# EAGLE design power scheduler (EAGLE 8.6.3)
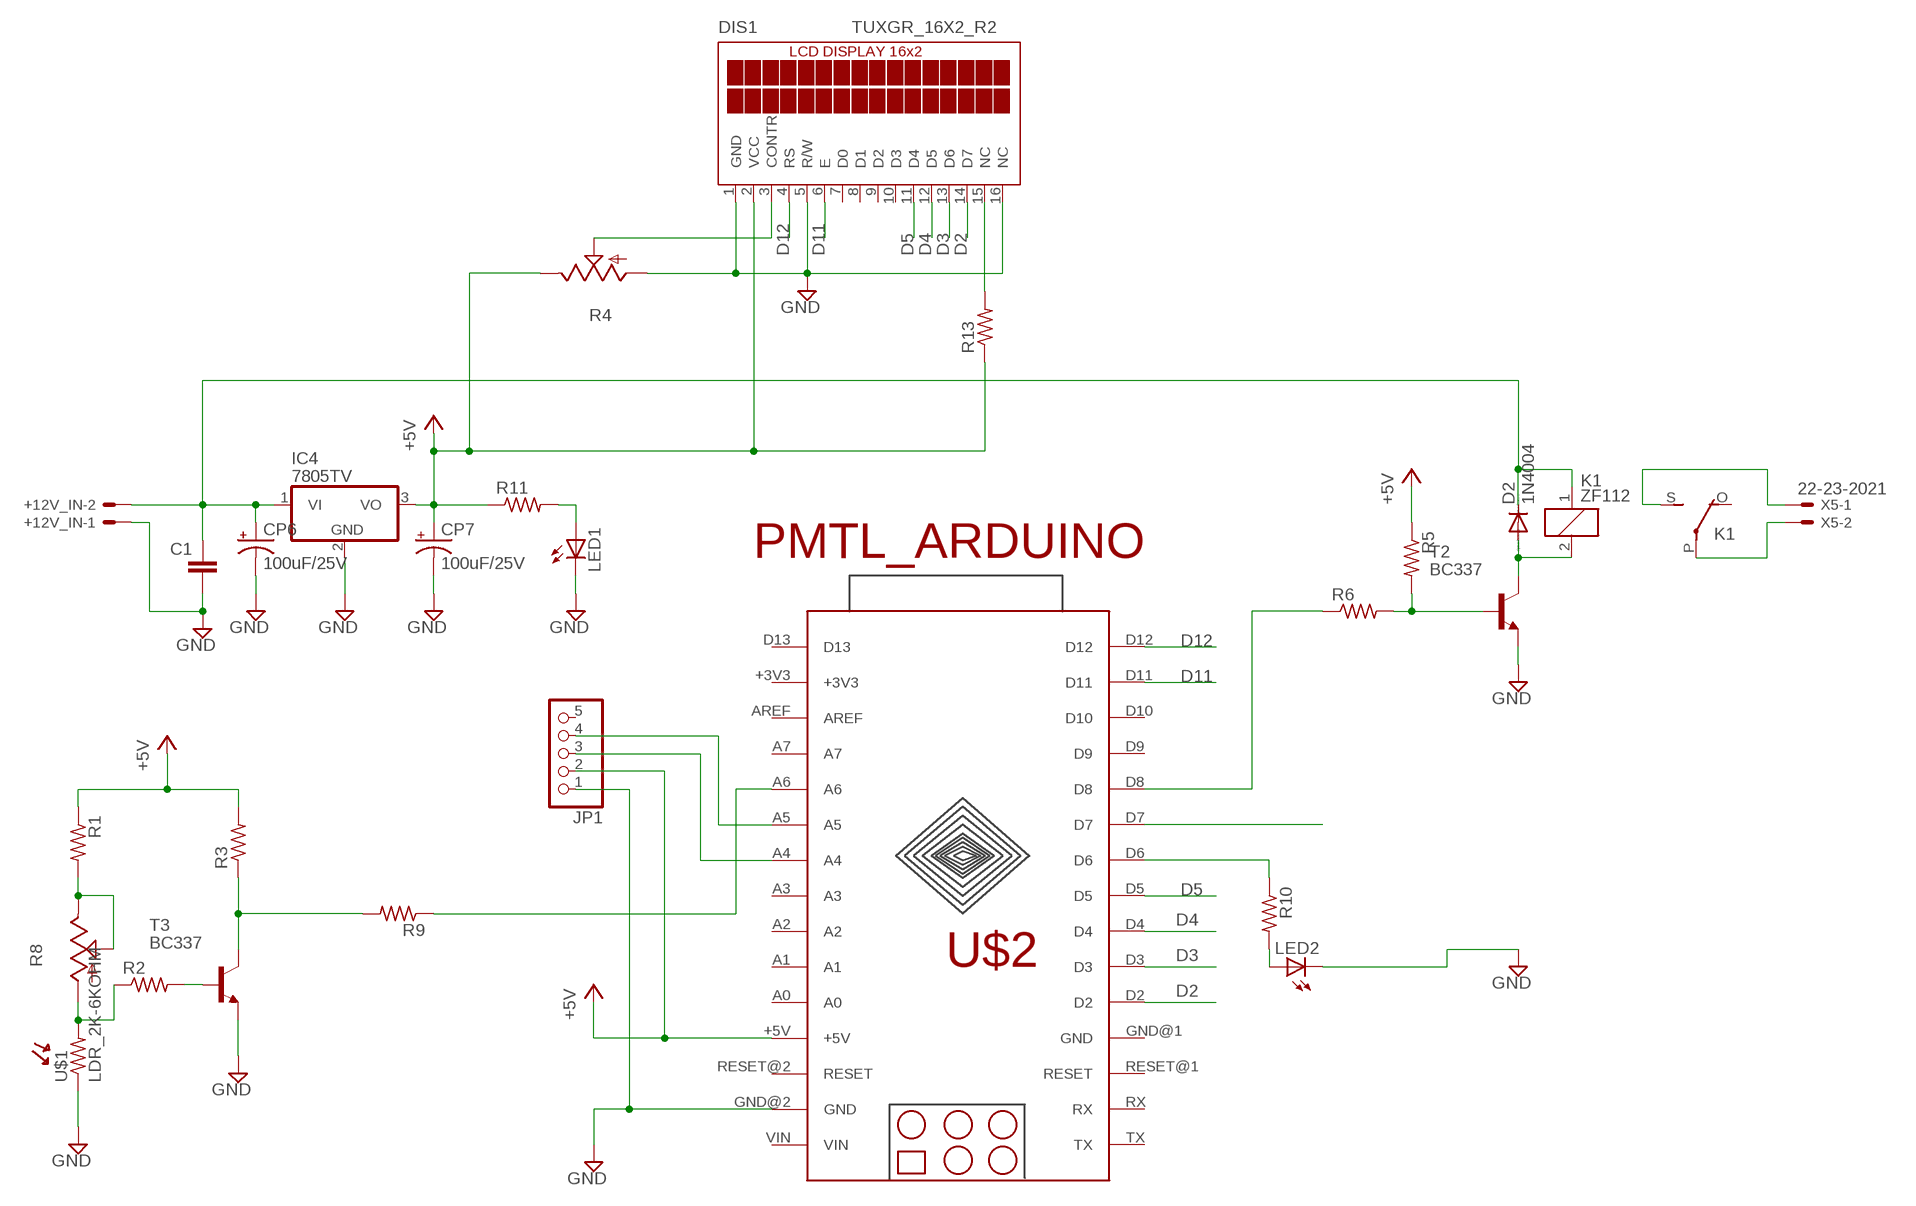
[diagram p0: schematic, sheet 1]

## Parts
+12V_IN  22-23-2021  [22-23-2021]
C1  C-EU025-025X050  [C025-025X050]
CP6  100uF/25V  CPOL-USE2-5  [E2-5]
CP7  100uF/25V  CPOL-USE2-5  [E2-5]
D2  1N4004  [DO41-10]
DIS1  TUXGR_16X2_R2  [TUXGR_16X2_R2]
IC4  7805TV  [TO220V]
JP1  PINHD-1X5/90  [1X05/90]
K1  ZF112  [ZF112]
LED1  LED3MM  [LED3MM]
LED2  LED3MM  [LED3MM]
R1  R-US_0204/7  [0204/7]
R2  R-US_0204/7  [0204/7]
R3  R-US_0204/7  [0204/7]
R4  TRIM  [6MM]
R5  R-US_0204/7  [0204/7]
R6  R-US_0204/7  [0204/7]
R8  TRIM  [6MM]
R9  R-US_0204/7  [0204/7]
R10  R-US_0204/7  [0204/7]
R11  R-US_0204/7  [0204/7]
R13  R-US_0204/7  [0204/7]
T2  BC337  [TO92]
T3  BC337  [TO92]
U$1  LDR_2K-6KOHM  [XDCR_PDV-P9003-1]
U$2  PMTL_ARDUINO  [PMTL_ARDUINO]
X5  22-23-2021  [22-23-2021]

## Nets
+5V: CP7.+ DIS1.2(VCC) IC4.3(VO) JP1.2 R1.1 R3.2 R4.E R5.1 R11.1 R13.1 U$2.+5V
D2: DIS1.14(D7) U$2.D2
D3: DIS1.13(D6) U$2.D3
D4: DIS1.12(D5) U$2.D4
D5: DIS1.11(D4) U$2.D5
D11: DIS1.6(E) U$2.D11
D12: DIS1.4(RS) U$2.D12
GND: +12V_IN.1 C1.2 CP6.- CP7.- DIS1.1(GND) DIS1.5(R/W) DIS1.16(NC) IC4.2(GND) JP1.1 LED1.K(C) LED2.K(C) R4.A T2.1(E) T3.1(E) U$1.1 U$2.GND@2(GND)
N$1: K1.S(2:S) X5.1
N$2: K1.P(2:P) X5.2
N$3: R2.1 R8.A U$1.2
N$4: R1.2 R8.E R8.S
N$5: D2.A K1.2 T2.3(C)
N$6: JP1.4 U$2.A5
N$7: +12V_IN.2 C1.1 CP6.+ D2.C IC4.1(VI) K1.1
N$9: R5.2 R6.2 T2.2(B)
N$11: R6.1 U$2.D8
N$13: R9.1 U$2.A6
N$14: JP1.3 U$2.A4
N$17: R2.2 T3.2(B)
N$18: R3.1 R9.2 T3.3(C)
N$19: LED1.A R11.2
N$21: LED2.A R10.2
N$22: DIS1.3(CONTR) R4.S
N$24: DIS1.15(NC) R13.2
N$33: R10.1 U$2.D6
N$34: U$2.D7
Unconnected: DIS1.7(D0) DIS1.8(D1) DIS1.9(D2) DIS1.10(D3) JP1.5 K1.O(2:O) U$2.+3V3 U$2.A0 U$2.A1 U$2.A2 U$2.A3 U$2.A7 U$2.AREF U$2.D9 U$2.D10 U$2.D13 U$2.GND@1(GND) U$2.RESET@1(RESET) U$2.RESET@2(RESET) U$2.RX U$2.TX U$2.VIN

## Library data of the parts
+12V_IN X5 = con-molex:22-23-2021: .100" (2.54mm) Center Header - 2 Pin; MF: MOLEX; MPN: 22-23-2021; OC_FARNELL: 1462926; OC_NEWARK: 25C3832
C1 = rcl:C-EU: CAPACITOR, European symbol; SPICEPREFIX: C
CP6 CP7 = rcl:CPOL-US: POLARIZED CAPACITOR, American symbol; SPICEPREFIX: C
D2 = diode:1N4004: DIODE general purpose rectifier, 1 A
DIS1 = display-lcd:TUXGR_16X2_R2: Tuxgraphics LCD display 16x2 characters reflective, without background light Source: tuxgr_12x2_r2.pdf; OC_FARNELL: unknown; OC_NEWARK: unknown
IC4 = linear:78*: Positive VOLTAGE REGULATOR Source: http://cache.national.com/ds/LM/LM78L05.pdf http://www.fairchildsemi.com/ds/LM/LM7805.pdf
JP1 = pinhead:PINHD-1X5: PIN HEADER
K1 = relay:ZF112: RELAY 1 x switch; OC_FARNELL: unknown; OC_NEWARK: unknown
LED1 LED2 = adafruit:LED: LED OSRAM: - CHIPLED LG R971, LG N971, LY N971, LG Q971, LY Q971, LO R971, LY R971 LH N974, LH R974 LS Q976, LO Q976, LY Q976 LO Q996 - Hyper CHIPLED LW Q18S LB Q993, LB Q99A, LB R99A - SideLED LS A670, LO A670, LY A670, LG A670, LP A670 LB A673, LV A673, LT A673, LW A673 LH A674 LY A675 LS A676, LA A676, LO A676, LY A676, LW A676 LS A679, LY A679, LG A679 - Hyper Micro SIDELED® LS Y876, LA Y876, LO Y876, LY Y876 LT Y87S - SmartLED LW L88C, LW L88S LB L89C, LB L89S, LG L890 LS L89K, LO L89K, LY L89K LS L896, LA L896, LO L896, LY L896 - TOPLED LS T670, LO T670, LY T670, LG T670, LP T670 LSG T670, LSP T670, LSY T670, LOP T670, LYG T670 LG T671, LOG T671, LSG T671 LB T673, LV T673, LT T673, LW T673 LH T674 LS T676, LA T676, LO T676, LY T676, LB T676, LH T676, LSB T676, LW T676 LB T67C, LV T67C, LT T67C, LS T67K, LO T67K, LY T67K, LW E67C LS E67B, LA E67B, LO E67B, LY E67B, LB E67C, LV E67C, LT E67C LW T67C LS T679, LY T679, LG T679 LS T770, LO T770, LY T770, LG T770, LP T770 LB T773, LV T773, LT T773, LW T773 LH T774 LS E675, LA E675, LY E675, LS T675 LS T776, LA T776, LO T776, LY T776, LB T776 LHGB T686 LT T68C, LB T68C - Hyper Mini TOPLED® LB M676 - Mini TOPLED Santana® LG M470 LS M47K, LO M47K, LY M47K Source: http://www.osram.convergy.de/
R1-R3 R5 R6 R9-R11 R13 = rcl:R-US_: RESISTOR, American symbol; SPICEPREFIX: R
R4 R8 = adafruit:TRIM
T2 T3 = transistor:BC337: NPN TRANSISTOR
U$1 = PHOTO_RESISTOR:LDR_2K-6KOHM; DESIGNER: SIR-CHUKS
U$2 = PMTL_ARDUINO:PMTL_ARDUINO: PMTL-ARDUINO; DESIGNER: SIR-CHUKS

## Board
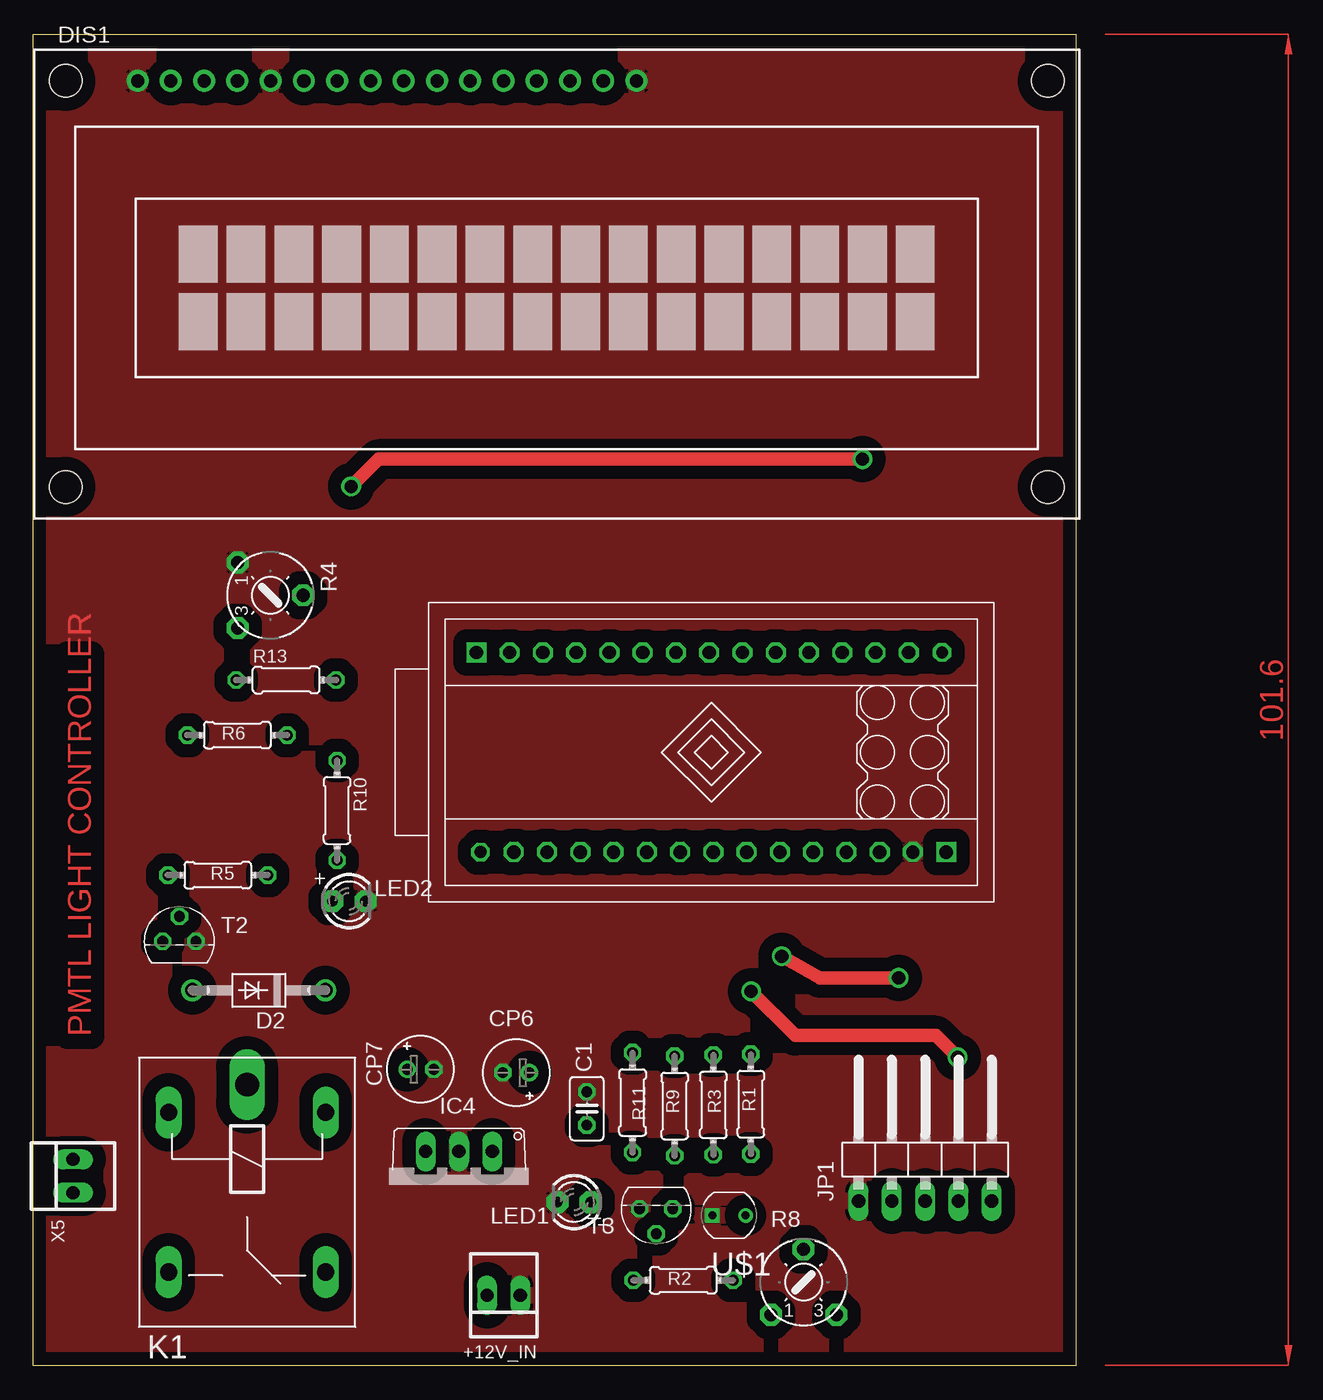
[diagram p1: board, top side]
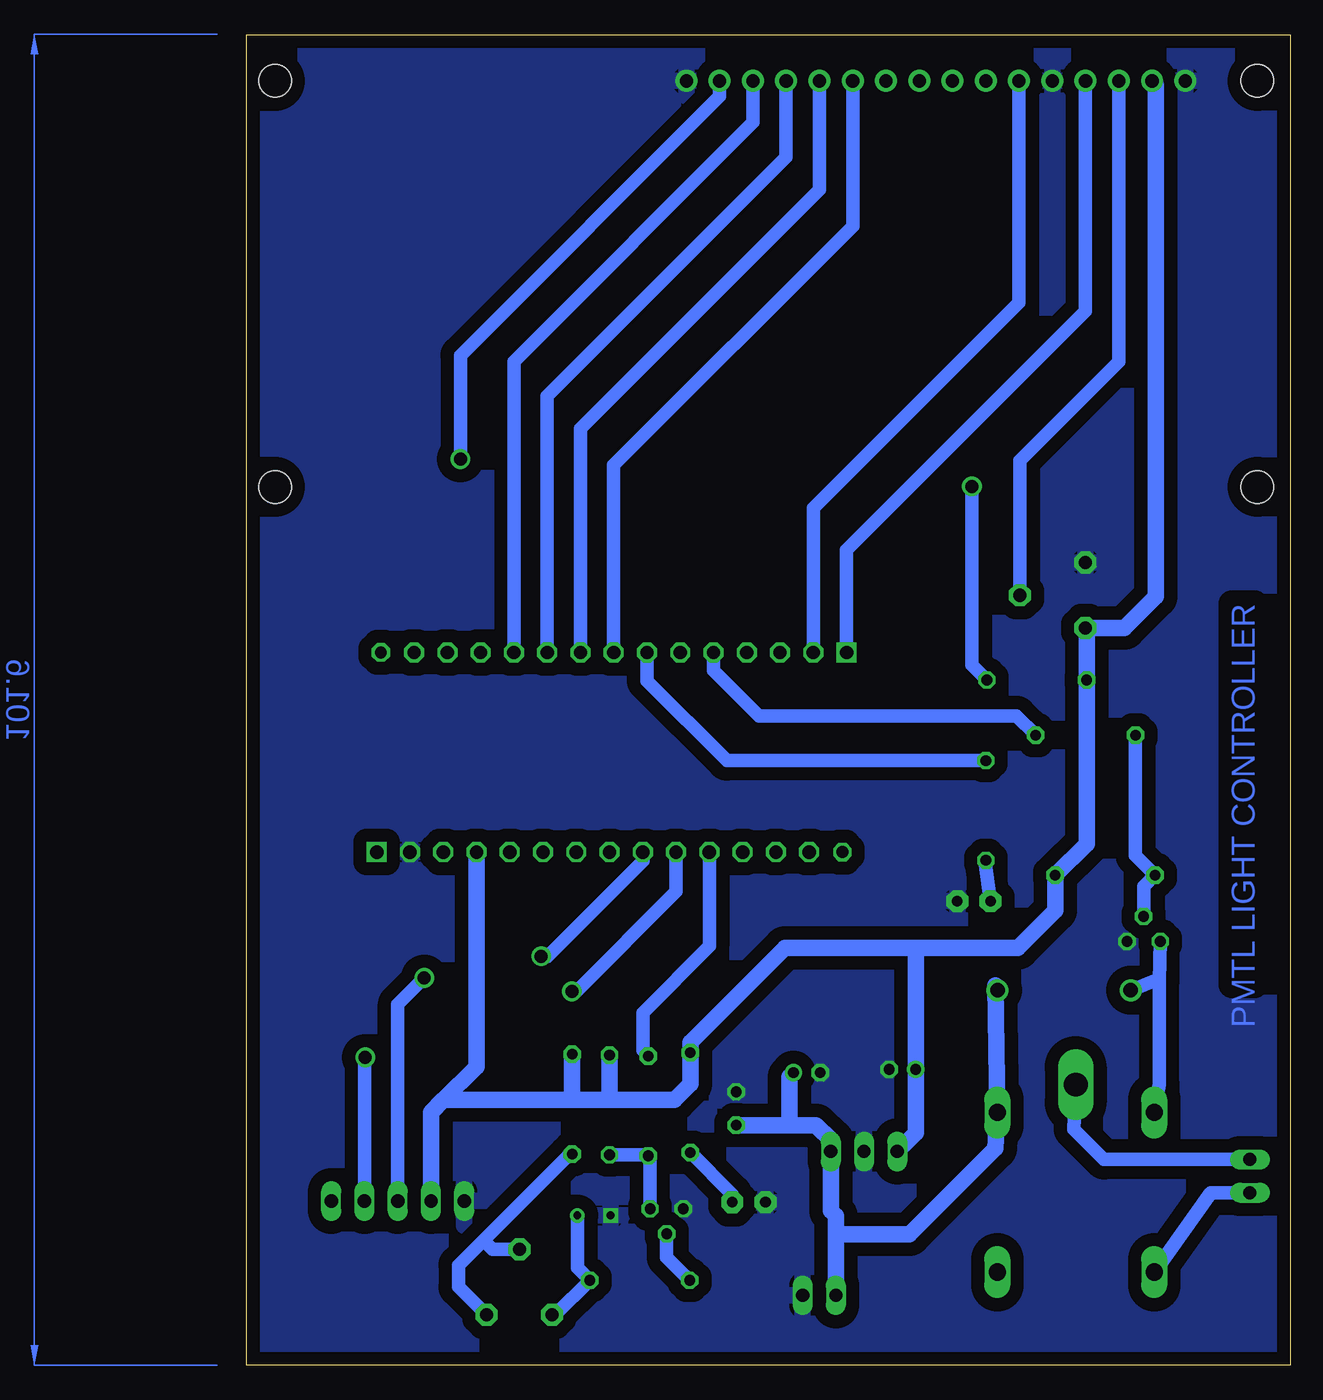
[diagram p2: board, bottom side, seen from below]

Size 79.68 x 101.59 mm. Coordinates in mm from the lower left corner, seen from the top.
Outline: 0,0 79.68,0 79.68,101.59 0,101.59 0,0
Copper layers (1*16): Top 0.035mm / dielectric 1.5mm / Bottom 0.035mm
Design rules "default": minimum track width 6mil, minimum drill 0.35mm, track to track 6mil, track to pad 6mil, pad to pad 6mil, via to via 6mil, smd to smd 6mil, copper to edge 40mil, drill to drill 6mil, minimum pad ring 10mil, minimum via ring 8mil, stop-mask expansion 4mil, vias tented up to drill 0mil, thermal gap 10mil

### Footprints (pad centres in the part's own frame; a part is rotated, then mirrored left to right if it is on the bottom)
22-23-2021 = drill 1 long: 1 -1.27,0; 2 1.27,0
C025-025X050 = drill 0.813 octagon: 1 -1.27,0; 2 1.27,0
E2-5 = drill 0.813 pad 1.27: + -1.016,0 | drill 0.813 pad 1.27 octagon: - 1.016,0
DO41-10 = drill 1.118: A 5.08,0; C -5.08,0
TUXGR_16X2_R2 = drill 1 pad 1.676: 1 -32,15.5; 2 -29.46,15.5; 3 -26.92,15.5; 4 -24.38,15.5; 5 -21.84,15.5; 6 -19.3,15.5; 7 -16.76,15.5; 8 -14.22,15.5; 9 -11.68,15.5; 10 -9.14,15.5; 11 -6.6,15.5; 12 -4.06,15.5; 13 -1.52,15.5; 14 1.02,15.5; 15 3.56,15.5; 16 6.1,15.5 | hole 2.5: -37.5,-15.5; 37.5,-15.5; -37.5,15.5; 37.5,15.5
TO220V = drill 1.016 long: 1 -2.54,-2.54; 2 0,-2.54; 3 2.54,-2.54
1X05/90 = drill 1.016 long: 1 -5.08,-3.81; 2 -2.54,-3.81; 3 0,-3.81; 4 2.54,-3.81; 5 5.08,-3.81
ZF112 = drill 1.321 long: 1 -6.096,5.994; 2 -6.096,-5.994; O 6.096,5.994; S 6.096,-5.994 | drill 1.803 long: P -8.204,0
LED3MM = drill 0.813 pad 1.676 octagon: A -1.27,0; K 1.27,0
0204/7 = drill 0.813 octagon: 1 -3.81,0; 2 3.81,0
6MM = drill 1 pad 1.676 octagon: A -2.5,-2.5; E 2.5,-2.5; S 0,2.5
TO92 = drill 0.813 octagon: 1 1.27,0; 2 0,1.905; 3 -1.27,0
XDCR_PDV-P9003-1 = drill 0.6 pad 1 square: 1 -1.27,0 | drill 0.6 pad 1: 2 1.27,0
PMTL_ARDUINO = drill 1.016 octagon: +3V3 15.081,7.62; +5V -10.319,7.62; A0 -7.779,7.62; A1 -5.239,7.62; A2 -2.699,7.62; A3 -0.159,7.62; A4 2.381,7.62; A5 4.921,7.62; A6 7.461,7.62; A7 10.001,7.62; AREF 12.541,7.62; D2 -7.461,-7.62; D3 -4.921,-7.62; D4 -2.381,-7.62; D5 0.159,-7.62; D6 2.699,-7.62; D7 5.239,-7.62; D8 7.779,-7.62; D9 10.319,-7.62; D10 12.859,-7.62; D11 15.399,-7.62; GND@1 -10.001,-7.62; GND@2 -15.399,7.62; RESET@1 -12.541,-7.62; RESET@2 -12.859,7.62; RX -15.081,-7.62 | drill 1.016 square: D12 17.939,-7.62; VIN -17.939,7.62 | drill 0.9 octagon: D13 17.621,7.62; TX -17.621,-7.62

### Placement (x,y rotation side)
+12V_IN  35.96,5.32 180 top
C1  42.31,19.59 90 top
CP6  36.91,22.32 180 top
CP7  29.61,22.58 0 top
D2  17.26,28.61 180 top
DIS1  40.01,82.55 0 top
IC4  32.54,13.77 180 top
JP1  68.14,16.33 0 top
K1  16.37,13.2 270 top
LED1  41.33,12.44 180 top
LED2  24.15,35.42 0 top
R1  54.83,19.92 270 top
R2  49.67,6.47 180 top
R3  51.97,19.86 90 top
R4  18.14,58.78 270 top
R5  14.13,37.41 180 top
R6  15.62,48.1 180 top
R8  58.86,6.33 0 top
R9  49.01,19.78 270 top
R10  23.24,42.35 270 top
R11  45.8,20.04 270 top
R13  19.35,52.31 0 top
T2  11.19,32.35 0 top
T3  47.61,11.93 180 top
U$1  53.16,11.43 0 top
U$2  51.81,46.79 180 top
X5  3.08,14.43 90 top

### Tracks (layer width: path | path; a pad name or v marks a point on that pad's centre or on a via)
+5V
  Bottom 1.27: IC4.3 28.59,17.72 CP7.+ 28.59,31.75 28.48,31.87 | DIS1.2 10.26,97.76 10.26,58.7 12.68,56.28 R4.E 15.54,56.18 R13.1 15.54,39.81 R5.1 17.94,34.71 20.78,31.87 28.48,31.87 | 28.48,31.87 38.58,31.87 45.8,24.65 R11.1 45.8,21.47 47.03,20.24 51.89,20.24 | U$2.+5V 62.13,22.78 64.67,20.24 | JP1.2 65.6,19.31 64.67,20.24 | 51.89,20.24 54.65,20.24 | 54.65,20.24 57.15,20.24 64.67,20.24 | R3.2 51.97,20.32 51.89,20.24 | R1.1 54.83,20.42 54.65,20.24
D2
  Bottom 1.016: DIS1.14 41.02,94.89 59.27,76.64 U$2.D2
D3
  Bottom 1.016: DIS1.13 38.48,92.23 56.73,73.98 U$2.D3
D4
  Bottom 1.016: DIS1.12 35.95,89.75 54.19,71.5 U$2.D4
D5
  Bottom 1.016: DIS1.11 33.41,86.97 51.65,68.72 U$2.D5
D11
  Bottom 1.016: DIS1.6 20.7,81.13 33.59,68.25 34.23,67.61 36.41,65.43 U$2.D11
D12
  Bottom 1.016: DIS1.4 15.62,80.48 33.87,62.23 U$2.D12
GND
  pour Top (isolate 1.016): 0,101.6 80.01,101.6 80.01,0 0,0
  pour Bottom (isolate 1.016): 0,101.6 80.01,101.6 80.01,0 0,0
N$1
  Bottom 1.016: K1.S 6.07,13.16 X5.1
N$2
  Bottom 1.016: X5.2 14.23,15.7 16.53,18 K1.P
N$3
  Bottom 1.016: U$1.2 54.43,7.42 R2.1 56.12,3.83 R8.A
N$4
  Bottom 1.016: R1.2 55.01,16.11 61.59,9.53 | R8.E 63.5,5.97 63.5,7.62 61.59,9.53 | R8.S 60.9,8.83 61.59,9.53
N$5
  Bottom 1.016: K1.2 9.98,21.43 9.98,29.33 | 9.98,29.33 T2.3 | D2.A 10.1,29.45 9.98,29.33
N$6  (via drill 1)
  Top 1.016: v70.62,23.49 68.96,25.16 58.22,25.16 v54.85,28.53
  Bottom 1.016: v70.62,23.49 70.68,23.44 JP1.4 | U$2.A5 46.89,36.16 54.51,28.53 v54.85,28.53
N$7
  Bottom 1.27: +12V_IN.2 34.69,9.98 | 34.69,9.98 34.69,11.39 35.08,11.79 IC4.1 35.08,17.2 36.2,18.32 38.24,18.32 | C1.1 38.24,18.32 | CP6.+ 38.24,22.01 38.24,18.32 | D2.C 22.52,28.99 K1.1 22.52,16.55 29.09,9.98 34.69,9.98
N$9
  Bottom 1.016: T2.2 11.19,36.53 R5.2 11.81,38.89 R6.2
N$11
  Bottom 1.016: R6.1 20.89,49.57 40.56,49.57 44.03,53.04 U$2.D8
N$13
  Bottom 1.016: R9.1 49.43,24.01 49.43,26.91 44.35,31.99 U$2.A6
N$14  (via drill 1)
  Top 1.016: v66.12,29.57 60.11,29.57 v57.19,31.21
  Bottom 1.016: JP1.3 68.14,27.54 v66.12,29.57 | U$2.A4 49.43,38.48 56.69,31.21 v57.19,31.21
N$17
  Bottom 1.016: T3.2 47.6,8.21 R2.2
N$18
  Bottom 1.016: T3.3 48.88,15.83 R9.2 49.09,16.05 R3.1
N$19
  Bottom 1.016: LED1.A 42.6,13.04 R11.2
N$21
  Bottom 1.016: LED2.A 23.3,38.48 R10.2
N$22
  Bottom 1.016: DIS1.3 13.09,76.61 20.64,69.06 R4.S
N$24  (via drill 1)
  Top 1.016: v63.36,69.18 26.39,69.18 v24.31,67.09
  Bottom 1.016: DIS1.15 43.56,96.89 63.36,77.09 v63.36,69.18 | v24.31,67.09 24.31,53.46 R13.2
N$33
  Bottom 1.016: R10.1 43.02,46.16 49.11,52.25 U$2.D6
(copper drawn outside any net)
  shapes: Bottom area x2, Top area x2

### Text on the board
Top: PMTL LIGHT CONTROLLER
Bottom: PMTL LIGHT CONTROLLER